# EAGLE design Starter (EAGLE 9.6.2)

## Sheet 1 of 2
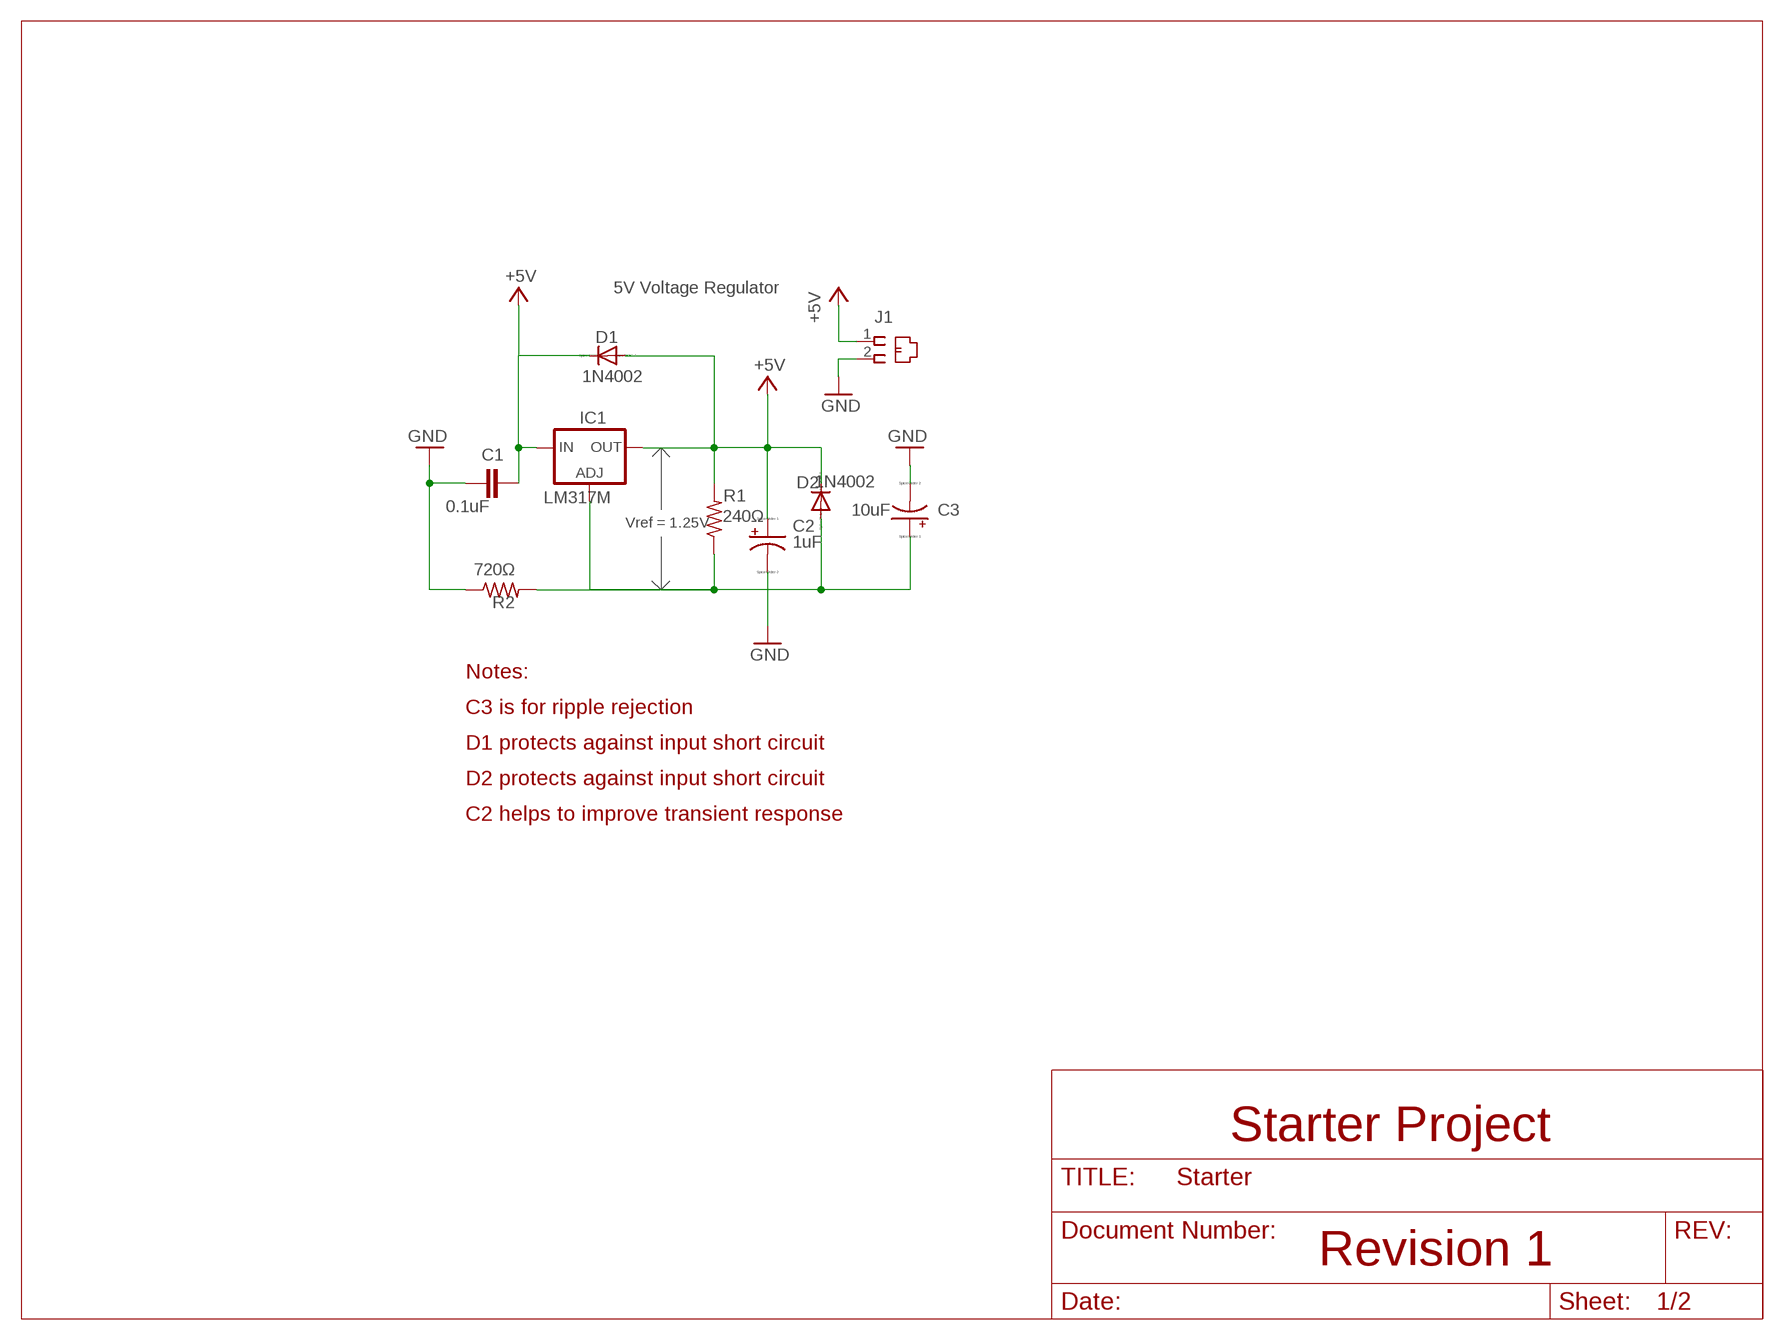
[diagram p0: schematic, sheet 1]

### Parts
C1  0.1uF  C-EU075-052X106  [C075-052X106]
C2  1uF  CPOL-US085CS-1AR  [085CS_1AR]
C3  10uF  CPOL-US085CS-1AR  [085CS_1AR]
D1  1N4002  1N4004  [DO41-10]
D2  1N4002  1N4004  [DO41-10]
IC1  LM317MBSTT3  [SOT223]
J1  520250-1  [520250-1]
R1  240Ω  R-US_M0805  [M0805]
R2  720Ω  R-US_M0805  [M0805]

### Nets
+5V: C1.1 C2.+ D1.A D1.C D2.C IC1.3(IN) IC1.4(OUT) J1.1 R1.2
GND: C1.2 C2.- C3.- J1.2 R2.1
N$1: C3.+ D2.A IC1.1(ADJ) R1.1 R2.2

### Notes on the sheet
- 5V Voltage Regulator
- Vref = 1.25V
- Notes:
- C3 is for ripple rejection
- D1 protects against input short circuit
- D2 protects against input short circuit
- C2 helps to improve transient response
- Starter Project
- Revision 1

## Sheet 2 of 2

## Library data of the parts
C1 = rcl:C-EU: CAPACITOR, European symbol
C2 C3 = resistor:CPOL-US: POLARIZED CAPACITOR, American symbol
D1 D2 = diode:1N4004: DIODE general purpose rectifier, 1 A
IC1 = v-reg:LM317?*: 500 mA Adjustable Output Positive Voltage Regulator Source: http://www.onsemi.co.jp .. LM317M-D.PDF; PARTNUMBER: LM317M
J1 = con-amp:520250-1: AMP connector
R1 R2 = resistor:R-US_: RESISTOR, American symbol

## Board
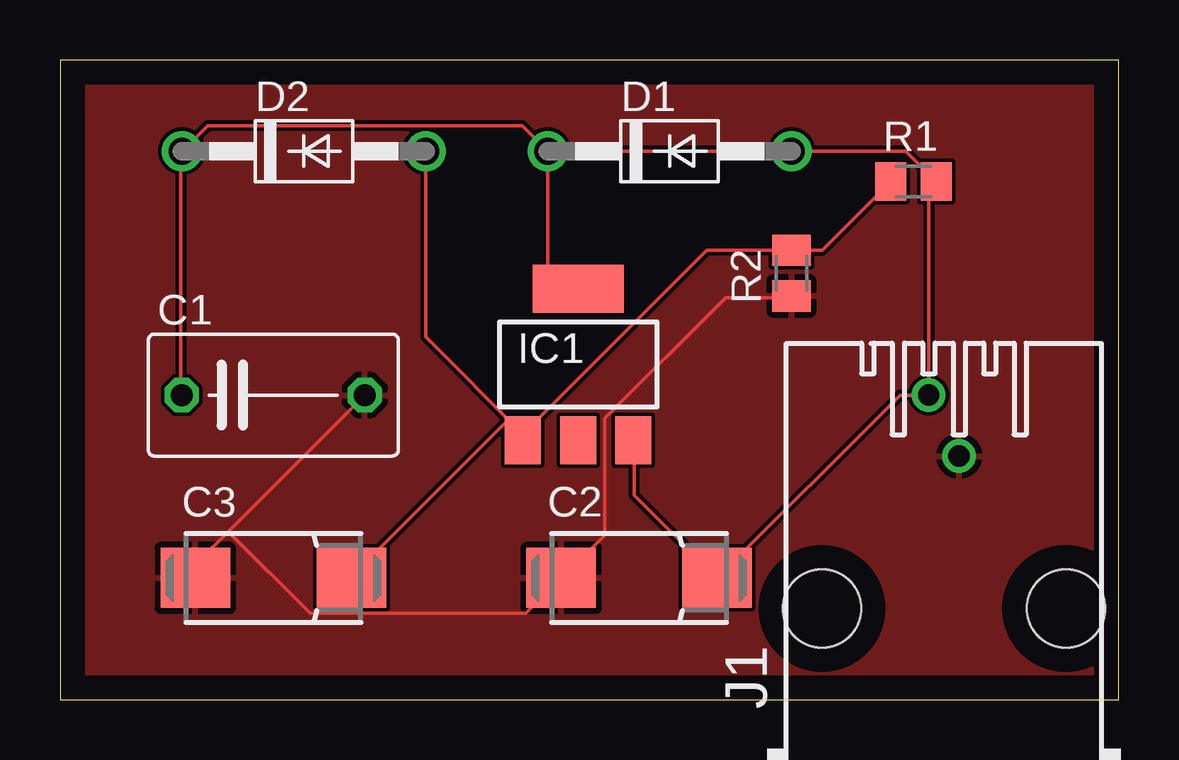
[diagram p1: board, top side]
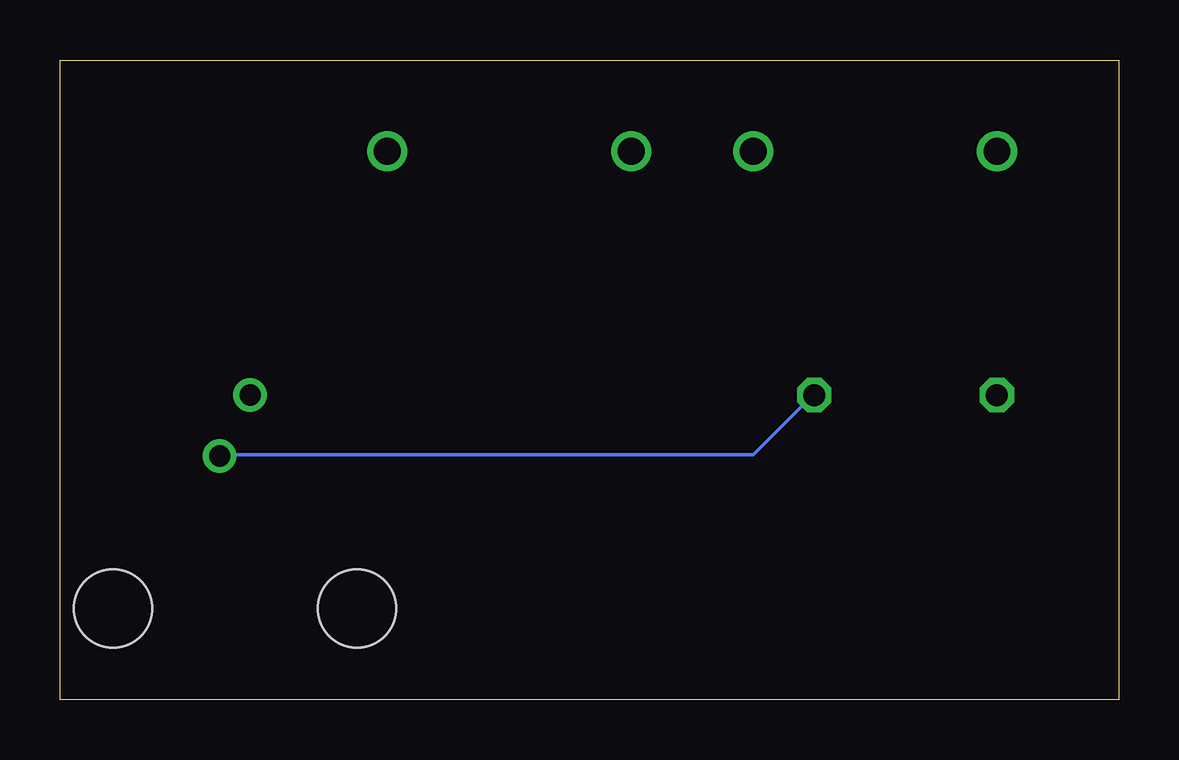
[diagram p2: board, bottom side, seen from below]

Size 44.12 x 26.66 mm. Coordinates in mm from the lower left corner, seen from the top.
Outline: 0,0 44.12,0 44.12,26.66 0,26.66 0,0
Copper layers (1*16): Top 0.035mm / dielectric 1.5mm / Bottom 0.035mm
Design rules "default": minimum track width 6mil, minimum drill 0.35mm, track to track 6mil, track to pad 6mil, pad to pad 6mil, via to via 6mil, smd to smd 6mil, copper to edge 40mil, drill to drill 6mil, minimum pad ring 10mil, minimum via ring 8mil, stop-mask expansion 4mil, vias tented up to drill 0mil, thermal gap 10mil

### Footprints (pad centres in the part's own frame; a part is rotated, then mirrored left to right if it is on the bottom)
C075-052X106 = drill 0.914 octagon: 1 -3.81,0; 2 3.81,0
085CS_1AR = smd 2.9 x 2.5: + 3.25,0; - -3.25,0
DO41-10 = drill 1.118: A 5.08,0; C -5.08,0
SOT223 = smd 1.5 x 2: 1 -2.3,-3.15; 2 0,-3.15; 3 2.3,-3.15 | smd 3.8 x 2: 4 0,3.15
520250-1 = drill 0.889: 1 -0.635,8.89; 2 0.635,6.35 | hole 3.251: -5.08,0; 5.08,0
M0805 = smd 1.3 x 1.6: 1 -0.95,0; 2 0.95,0

### Placement (x,y rotation side)
C1  8.89,12.7 0 top
C2  24.13,5.08 0 top
C3  8.89,5.08 0 top
D1  25.4,22.86 0 top
D2  10.16,22.86 0 top
IC1  21.59,13.97 0 top
J1  36.83,3.81 0 top
R1  35.56,21.59 0 top
R2  30.48,17.78 90 top

### Tracks (layer width: path | path; a pad name or v marks a point on that pad's centre or on a via)
+5V
  Top 0.152: D1.C 20.32,17.49 20.69,17.12 IC1.4 | D1.C 19.25,23.93 6.15,23.93 D2.C 5.03,22.86 5.03,12.8 C1.1 | IC1.3 23.93,10.67 23.93,8.53 27.28,5.18 C2.+ 35,12.7 J1.1 36.2,21.27 R1.2 35.24,22.86 D1.A D1.C
GND
  Top 0.152: R2.1 30.48,16.76 27.74,16.76 22.71,11.73 22.71,6.86 21.03,5.18 C2.- 19.4,3.6 10.42,3.6 7.01,7.01 | C1.2 7.01,7.01 | 7.01,7.01 5.79,5.79 5.79,5.18 C3.-
  Bottom 0.152: J1.2 37.34,10.21 15.24,10.21 12.8,12.65 C1.2
  pour Top: 0,26.67 0,0 44.45,0 44.45,26.67
N$1
  Top 0.152: 19.29,11.07 26.95,18.73 R2.2 31.75,18.73 R1.1 | D2.A 15.24,15.12 19.29,11.07 | 19.29,11.07 IC1.1 18.59,11.73 18.59,11.58 12.19,5.18 C3.+